# Altium schematic sheet 07.SchDoc
size 297 x 209 mm
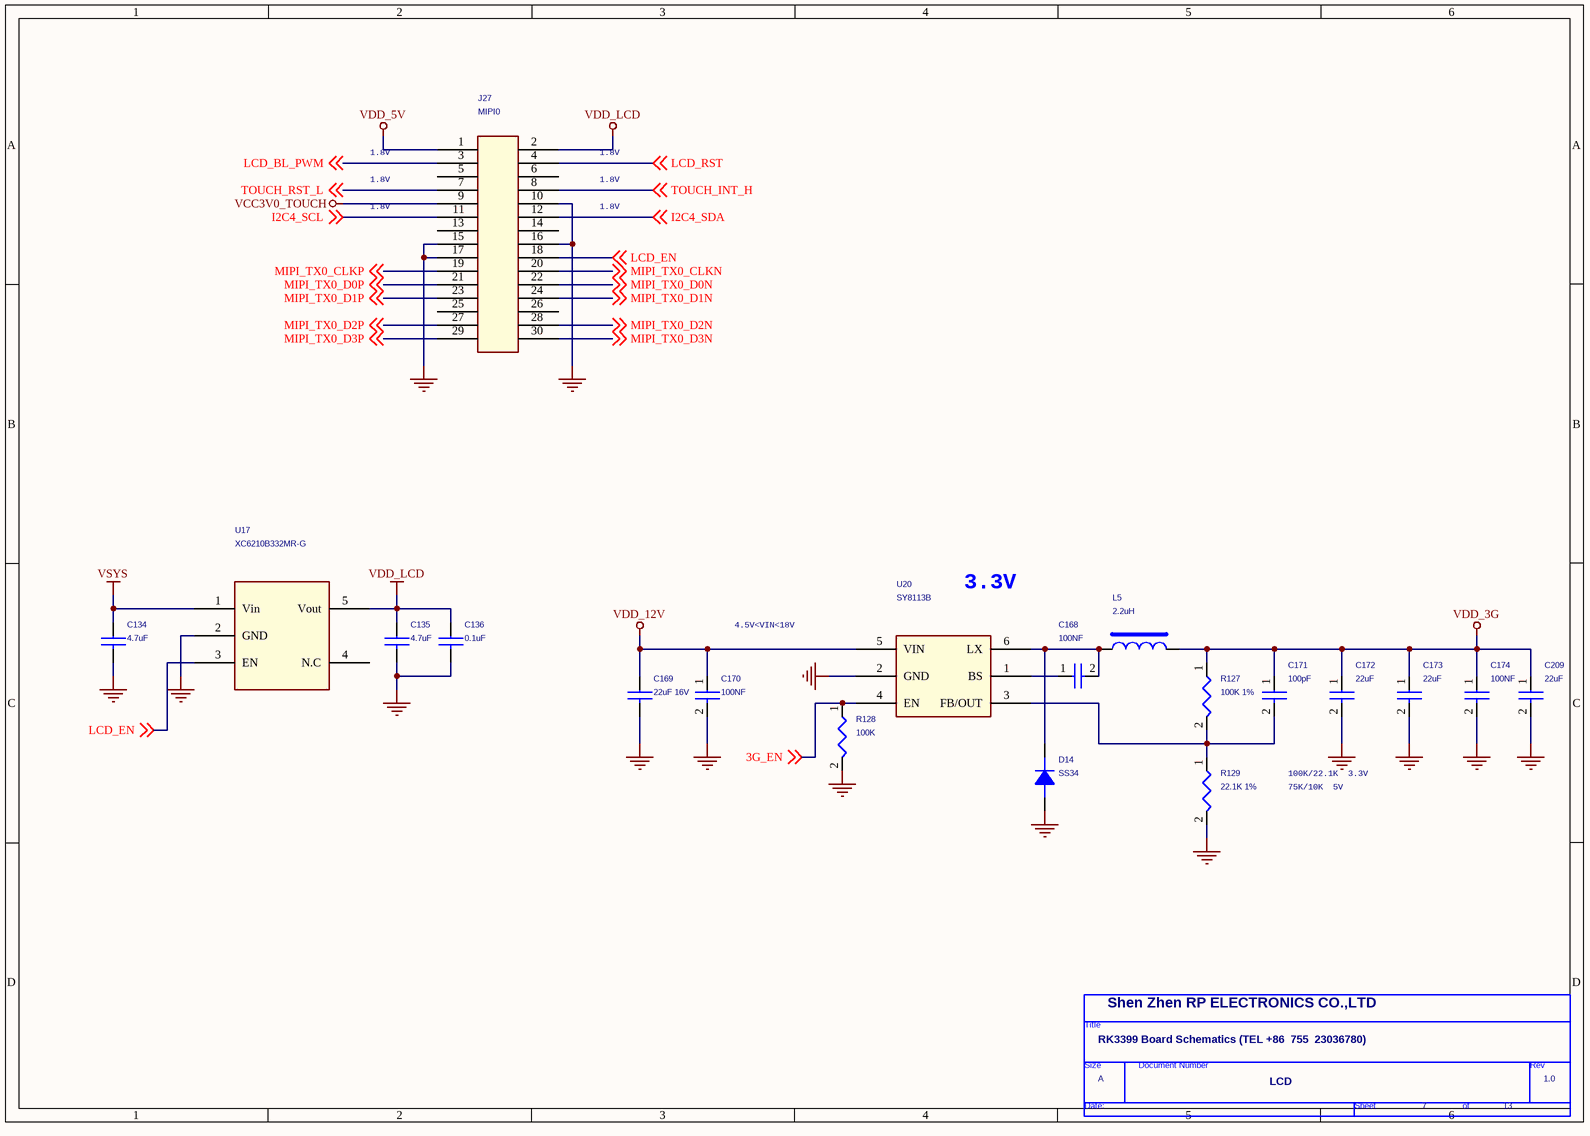
[diagram p0: 07.SchDoc]

## Parts
*  Doc: LCD  RevCode: 1.0  Title: RK3399 Board Schematics (TEL +86  755  23036780)  Page Size: A  Page Number: 7  Page Count: 13  Cage Code: Shen Zhen RP ELECTRONICS CO.,LTD  (hidden comment: TitleBlock0)  (graphical)
C134  4.7uF  [0805C]
C135  4.7uF  [0805C]
C136  0.1uF  [0805C]
C168  100NF  [0805C]
C169  22uF 16V  [3216C]
C170  100NF  [0805C]
C171  100pF  [0805C]
C172  22uF  [0805C]
C173  22uF  [0805C]
C174  100NF  [0805C]
C209  22uF  [0805C]
D14  SS34  [DO-214AC]
J27  MIPI0  [idc30p-2d0]
L5  2.2uH  [l5d18]
R127  100K 1%  [0805]
R128  100K  [0805]
R129  22.1K 1%  [0805]
U17  XC6210B332MR-G  [SOT23-5]
U20  SY8113B  [SOT23-6]

## Nets
GND: C134.2 C135.2 C136.2 C169.2 C170.2 C172.2 C173.2 C174.2 C209.2 D14.1(A) J27.10 J27.15 J27.16 J27.17 R128.2 R129.2 U17.2(GND) U20.2(GND)
VCC3V0_TOUCH: J27.9
VDD_3G: C171.1 C172.1 C173.1 C174.1 C209.1 L5.2 R127.1
VDD_5V: J27.1
VDD_12V: C169.1 C170.1 U20.5(VIN)
VDD_LCD: C135.1 C136.1 J27.2 U17.5(Vout)
VSYS: C134.1 U17.1(Vin)
3G_EN: R128.1 U20.4(EN) ; off-sheet 3G_EN
I2C4_SCL: J27.11 ; off-sheet I2C4_SCL
I2C4_SDA: J27.12 ; off-sheet I2C4_SDA
LCD_BL_PWM: J27.3 ; off-sheet LCD_BL_PWM
LCD_EN: J27.18 U17.3(EN) ; off-sheet LCD_EN
LCD_RST: J27.4 ; off-sheet LCD_RST
MIPI_TX0_CLKN: J27.20 ; off-sheet MIPI_TX0_CLKN
MIPI_TX0_CLKP: J27.19 ; off-sheet MIPI_TX0_CLKP
MIPI_TX0_D0N: J27.22 ; off-sheet MIPI_TX0_D0N
MIPI_TX0_D0P: J27.21 ; off-sheet MIPI_TX0_D0P
MIPI_TX0_D1N: J27.24 ; off-sheet MIPI_TX0_D1N
MIPI_TX0_D1P: J27.23 ; off-sheet MIPI_TX0_D1P
MIPI_TX0_D2N: J27.28 ; off-sheet MIPI_TX0_D2N
MIPI_TX0_D2P: J27.27 ; off-sheet MIPI_TX0_D2P
MIPI_TX0_D3N: J27.30 ; off-sheet MIPI_TX0_D3N
MIPI_TX0_D3P: J27.29 ; off-sheet MIPI_TX0_D3P
TOUCH_INT_H: J27.8 ; off-sheet TOUCH_INT_H
TOUCH_RST_L: J27.7 ; off-sheet TOUCH_RST_L
NetC168_1: C168.1 U20.1(BS)
NetC168_2: C168.2 D14.2(K) L5.1 U20.6(LX)
NetC171_2: C171.2 R127.2 R129.1 U20.3(FB/OUT)

Not connected (* = marked no-connect by the designer): J27 5 6 13 14 25 26; U17 4(N.C)

## Notes on the sheet
- 1.8V
- 3.3V
- 4.5V<VIN<18V
- 100K/22.1K  3.3V
- 75K/10K  5V
- (in symbol TitleBlock0) Title; Size; Document Number; Rev; Date:; Sheet; of

## Library data of the parts
C134-C136 C169 = CAP NP_Dup8
C168 = CAP NP_Dup2: cap,100.00nF,+/-10%,25V,X5R,C0402; Manufacturer: TDK; RK PN: C1005X5R1E104K050BC; Priority: A; Tolerance: 10%; Voltage: 25V; Dielectric: X5R; Part Type: C0402; Manufacturer PN: C1005X5R1E104K050BC; Created by: JJJ
C170 = CAP NP_Dup2: cap,100.00nF,+/-10%,25V,X5R,C0402; Manufacturer PN: C1005X5R1E104K050BC; Manufacturer: TDK; Tolerance: 10%; Priority: A; Voltage: 25V; Dielectric: X5R; Created by: JJJ; Part Type: C0402; RK PN: C1005X5R1E104K050BC
C171 = CAP NP_Dup2: cap,100.00pF,+/-5%,50V,C0G,C0402; Manufacturer PN: C1005C0G1H101J050BA; Manufacturer: TDK; Tolerance: 5%; Priority: A; Voltage: 50V; Dielectric: C0G; Created by: JJJ; Part Type: C0402; RK PN: C1005C0G1H101J050BA
C172 C209 = CAP NP_Dup2: cap,22.00uF,+/-10%,10V,X5R,C0805; Manufacturer PN: C2012X5R1A226K125AB; Manufacturer: TDK; Tolerance: 10%; Priority: A; Voltage: 10V; Dielectric: X5R; Created by: JJJ; Part Type: C0805; RK PN: C2012X5R1A226K125AB
C173 = CAP NP_Dup2: cap,10.00uF,+/-10%,10V,X5R,C0805; Manufacturer PN: C2012X5R1A106K125AB; Manufacturer: TDK; Tolerance: 10%; Priority: A; Voltage: 10V; Dielectric: X5R; Created by: JJJ; Part Type: C0805; RK PN: C2012X5R1A106K125AB
C174 = CAP NP_Dup2: cap,100.00nF,+/-10%,16V,X5R,C0402; Manufacturer PN: C1005X5R1C104K050BA; Manufacturer: TDK; Tolerance: 10%; Priority: A; Voltage: 16V; Dielectric: X5R; Created by: JJJ; Part Type: C0402; RK PN: C1005X5R1C104K050BA
D14 = DIODE_Dup1
J27 = CON20_5
L5 = INDUCTORS OF FERRITE: Power Inductor,3.3uH,0.2,IND_404030; Manufacturer PN: SWPA4030S3R3MT; Manufacturer: sunlord; DC Resistor: 0.04ohm; Isat: 3.3A; Resonace frequency: 38M; Irms: 2.4A; Tolerance: 20%; Priority: A; Created by: YTL; Part Type: POWER_IND; RK PN: SWPA4030S3R3MT
R127 = RESISTOR_Dup1: 通用厚膜电阻,75K,+/-1%,R0402,1/16W.; Manufacturer: YAGEO; RK PN: RC0402FR-0775KL; Priority: A; Wattage: 1/16W; Tolerance: 1%; Part Type: 通用厚膜电阻; Manufacturer PN: RC0402FR-0775KL; Created by: YTL
R128 = RESISTOR_Dup1: 通用厚膜电阻,10K,+/-1%,R0402,1/16W.; Manufacturer: YAGEO; Tolerance: 1%; RK PN: RC0402FR-0710KL; Priority: A; Wattage: 1/16W; Part Type: 通用厚膜电阻; Manufacturer PN: RC0402FR-0710KL; Created by: YTL
R129 = RESISTOR_Dup1: 通用厚膜电阻,10K,+/-1%,R0402,1/16W.; Manufacturer PN: RC0402FR-0710KL; Manufacturer: YAGEO; Wattage: 1/16W; Priority: A; Tolerance: 1%; Created by: YTL; Part Type: 通用厚膜电阻; RK PN: RC0402FR-0710KL
U17 = XC6219_2
U20 = DCDC_SY8113: Manufacturer: Silergy（矽力杰）; Priority: A; Created by: JJJ; Manufacturer PN: SY8113B; Part Type: DCDC; RK PN: SY8113B
* = TitleBlock0: Page Create Date: March  8, 1995